# Altium project shahbazi2.PrjPcb
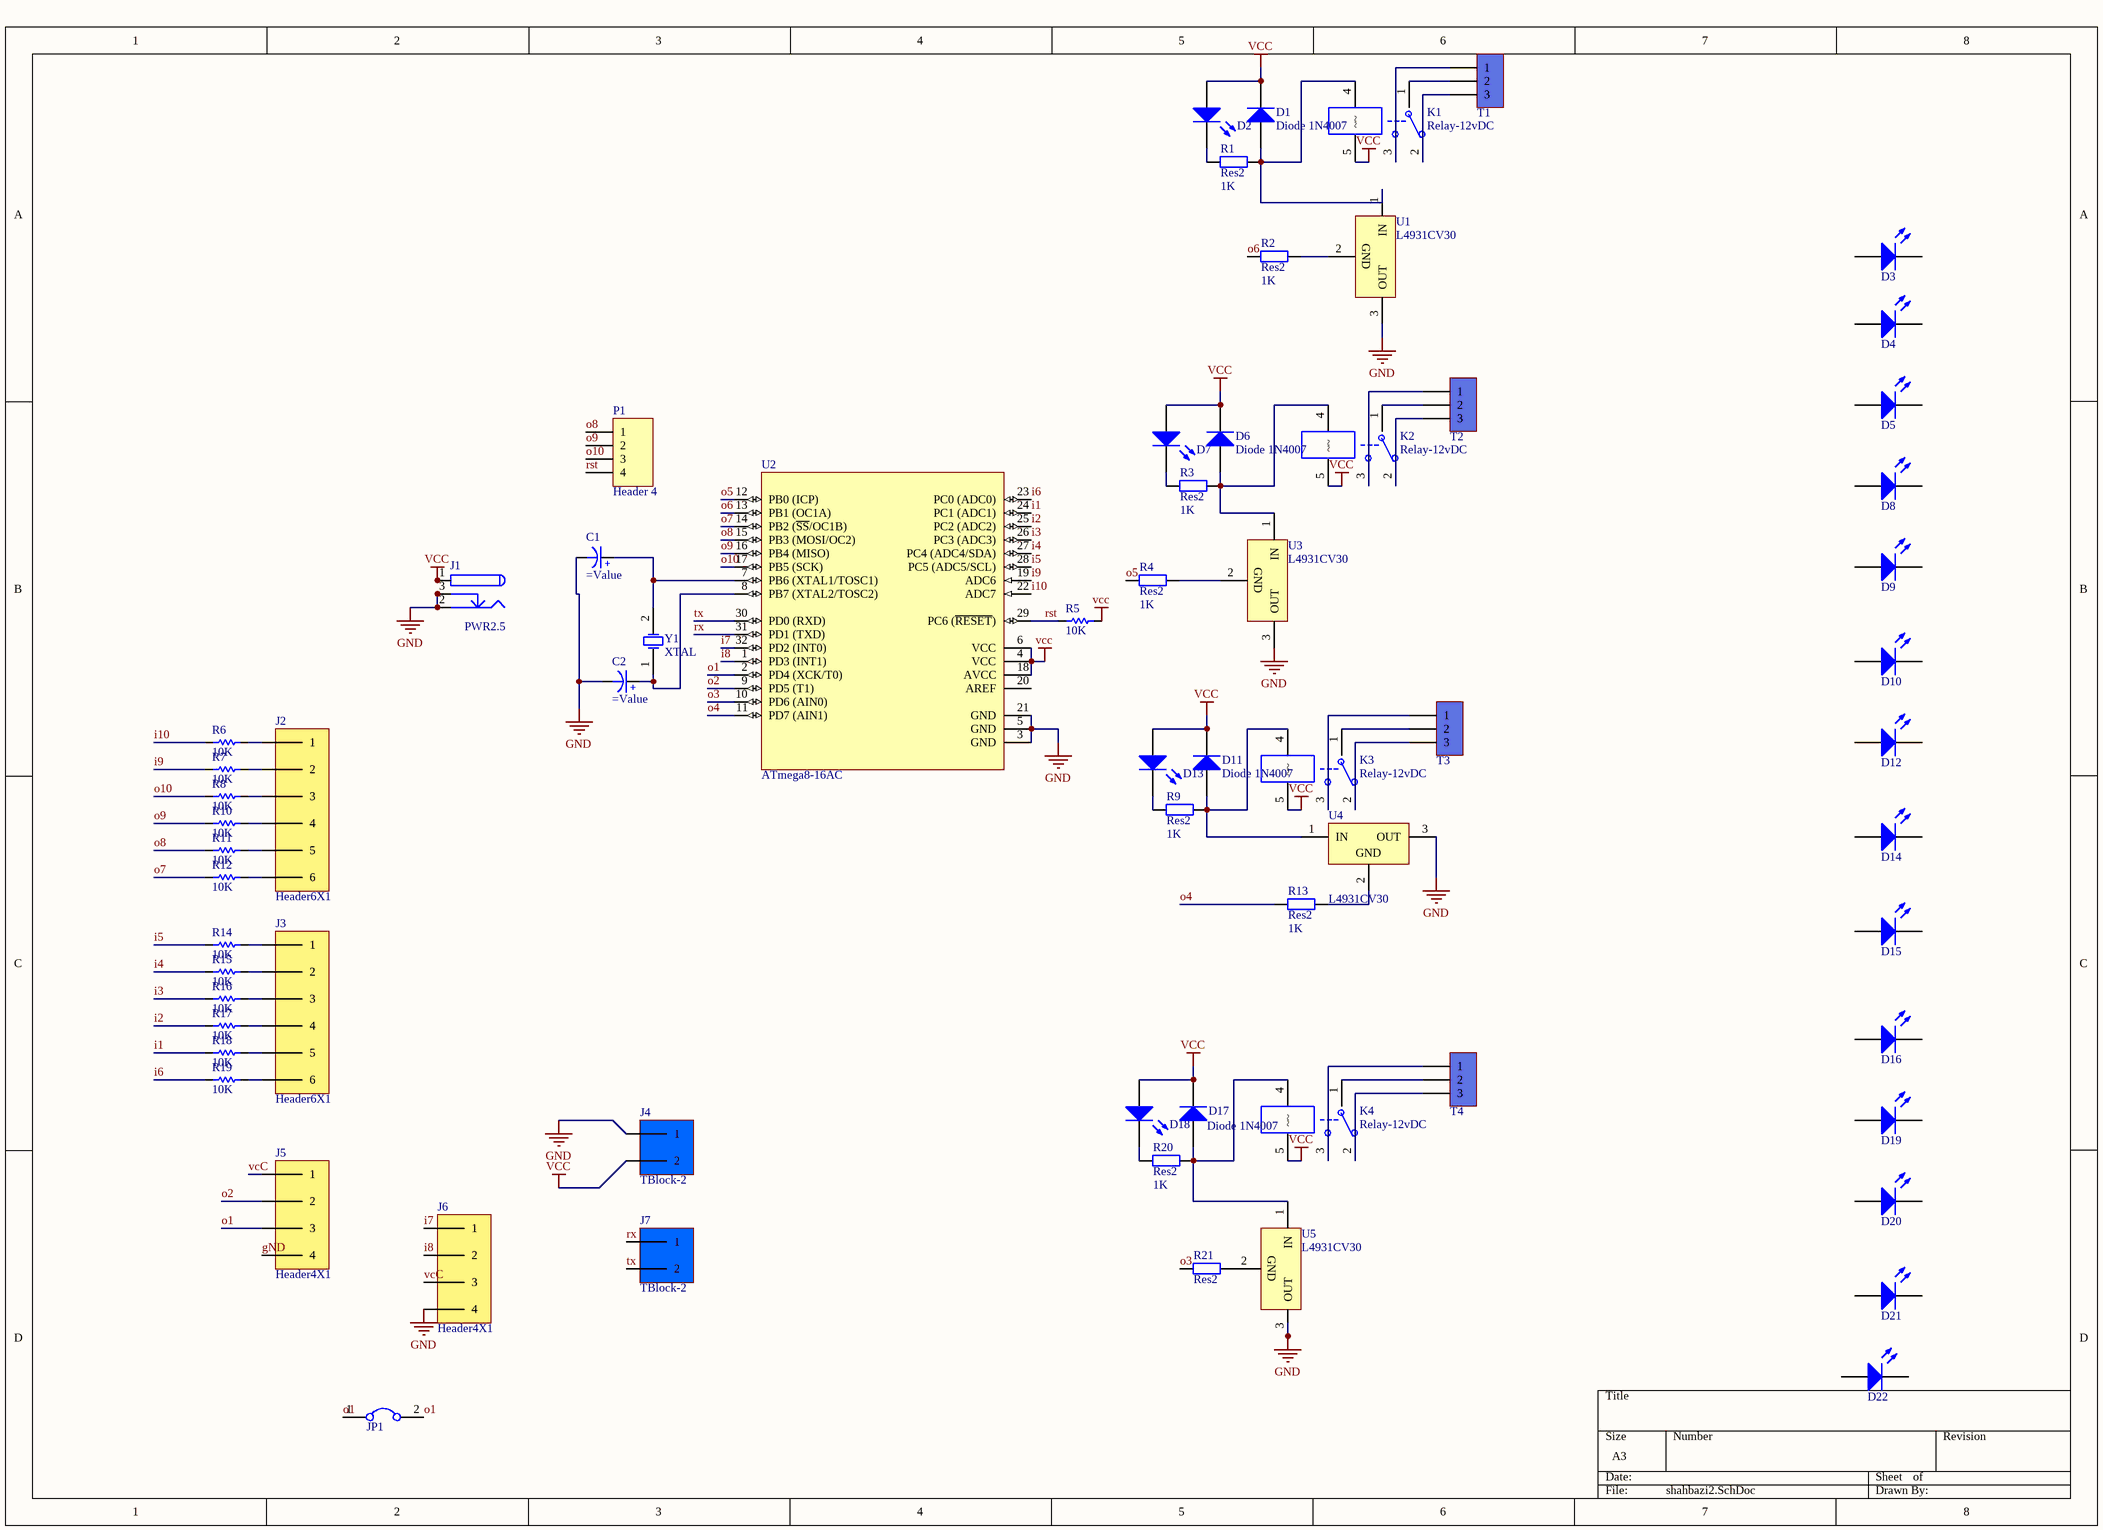
[diagram p0: shahbazi2.SchDoc]
1 sheet, 68 parts. Net scope: global (net labels, ports and power ports of the same name join across sheets).
Board file: shahbazi2.PcbDoc

## Sheet shahbazi2.SchDoc
size A3

### Parts
C1  (no value)  [ELEC-CAP-RAD10-20]
C2  (no value)  [ELEC-CAP-RAD10-20]
D1  Diode 1N4007  [DO-41]
D2  LED 3mm  [LED-3mm]  (value not drawn)
D3  LED 5mm  [LED-1]  (value not drawn)
D4  LED 5mm  [LED-1]  (value not drawn)
D5  LED 5mm  [LED-1]  (value not drawn)
D6  Diode 1N4007  [DO-41]
D7  LED 3mm  [LED-3mm]  (value not drawn)
D8  LED 5mm  [LED-1]  (value not drawn)
D9  LED 5mm  [LED-1]  (value not drawn)
D10  LED 5mm  [LED-1]  (value not drawn)
D11  Diode 1N4007  [DO-41]
D12  LED 5mm  [LED-1]  (value not drawn)
D13  LED 3mm  [LED-3mm]  (value not drawn)
D14  LED 5mm  [LED-1]  (value not drawn)
D15  LED 5mm  [LED-1]  (value not drawn)
D16  LED 5mm  [LED-1]  (value not drawn)
D17  Diode 1N4007  [DO-41]
D18  LED 3mm  [LED-3mm]  (value not drawn)
D19  LED 5mm  [LED-1]  (value not drawn)
D20  LED 5mm  [LED-1]  (value not drawn)
D21  LED 5mm  [LED-1]  (value not drawn)
D22  LED 5mm  [LED-1]  (value not drawn)
J1  PWR2.5  [KLD-0202]
J2  Header6X1  [HEADER 6X1]
J3  Header6X1  [HEADER 6X1]
J4  TBlock-2  [KF300-2 PIN]
J5  Header4X1  [HEADER 4X1]
J6  Header4X1  [HEADER 4X1]
J7  TBlock-2  [KF300-2 PIN]
JP1  Jumper  [Header 2X1]  (value not drawn)
K1  Relay-12vDC  [Relays]
K2  Relay-12vDC  [Relays]
K3  Relay-12vDC  [Relays]
K4  Relay-12vDC  [Relays]
P1  Header 4  [HDR1X4]
R1  Res2  value 1K  [Res50]
R2  Res2  value 1K  [Res50]
R3  Res2  value 1K  [Res50]
R4  Res2  value 1K  [Res50]
R5  10K  [RES 1206 (3216X08L)]
R6  10K  [Res-(1/4)]
R7  10K  [Res-(1/4)]
R8  10K  [Res-(1/4)]
R9  Res2  value 1K  [Res50]
R10  10K  [Res-(1/4)]
R11  10K  [Res-(1/4)]
R12  10K  [Res-(1/4)]
R13  Res2  value 1K  [Res50]
R14  10K  [Res-(1/4)]
R15  10K  [Res-(1/4)]
R16  10K  [Res-(1/4)]
R17  10K  [Res-(1/4)]
R18  10K  [Res-(1/4)]
R19  10K  [Res-(1/4)]
R20  Res2  value 1K  [Res50]
R21  Res2  [Res50]
T1  Terminal  [phoenix terminal R 3]  (value not drawn)
T2  Terminal  [phoenix terminal R 3]  (value not drawn)
T3  Terminal  [phoenix terminal R 3]  (value not drawn)
T4  Terminal  [phoenix terminal R 3]  (value not drawn)
U1  L4931CV30  [TO-220A]
U2  ATmega8-16AC  [32A_N]
U3  L4931CV30  [TO-220A]
U4  L4931CV30  [TO-220A]
U5  L4931CV30  [TO-220A]
Y1  XTAL  [R38]

### Nets
gND: C1.1(-) C2.1(-) J1.2 J1.2A J1.2B J1.3 J1.3A J1.3B J4.1 J5.4 J6.4 U1.3(OUT) U2.3(GND) U2.5(GND) U2.21(GND) U3.3(OUT) U4.3(OUT) U5.3(OUT)
vcC: D1.2(K) D2.1(A) D6.2(K) D7.1(A) D11.2(K) D13.1(A) D17.2(K) D18.1(A) J1.1 J1.1A J1.1B J4.2 J5.1 J6.3 K1.5 K2.5 K3.5 K4.5 R5.2 U2.4(VCC) U2.6(VCC) U2.18(AVCC)
i1: R18.1 U2.24(PC1_(ADC1))
i2: R17.1 U2.25(PC2_(ADC2))
i3: R16.1 U2.26(PC3_(ADC3))
i4: R15.1 U2.27(PC4_(ADC4/SDA))
i5: R14.1 U2.28(PC5_(ADC5/SCL))
i6: R19.1 U2.23(PC0_(ADC0))
i7: J6.1 U2.32(PD2_(INT0))
i8: J6.2 U2.1(PD3_(INT1))
i9: R7.1 U2.19(ADC6)
i10: R6.1 U2.22(ADC7)
o1: J5.3 JP1.1 JP1.2 U2.2(PD4_(XCK/T0))
o2: J5.2 U2.9(PD5_(T1))
o3: R21.1 U2.10(PD6_(AIN0))
o4: R13.1 U2.11(PD7_(AIN1))
o5: R4.1 U2.12(PB0_(ICP))
o6: R2.1 U2.13(PB1_(OC1A))
o7: R12.1 U2.14(PB2_(~{SS}/OC1B))
o8: P1.1 R11.1 U2.15(PB3_(MOSI/OC2))
o9: P1.2 R10.1 U2.16(PB4_(MISO))
o10: P1.3 R8.1 U2.17(PB5_(SCK))
rst: P1.4 R5.1 U2.29(PC6_(~{RESET}))
rx: J7.1 U2.31(PD1_(TXD))
tx: J7.2 U2.30(PD0_(RXD))
NetC1_2: C1.2(+) U2.7(PB6_(XTAL1/TOSC1)) Y1.2(OSC2)
NetC2_2: C2.2(+) U2.8(PB7_(XTAL2/TOSC2)) Y1.1(OSC1)
NetD1_1: D1.1(A) K1.4 R1.2 U1.1(IN)
NetD2_2: D2.2(K) R1.1
NetD6_1: D6.1(A) K2.4 R3.2 U3.1(IN)
NetD7_2: D7.2(K) R3.1
NetD11_1: D11.1(A) K3.4 R9.2 U4.1(IN)
NetD13_2: D13.2(K) R9.1
NetD17_1: D17.1(A) K4.4 R20.2 U5.1(IN)
NetD18_2: D18.2(K) R20.1
NetJ2_1: J2.1 R6.2
NetJ2_2: J2.2 R7.2
NetJ2_3: J2.3 R8.2
NetJ2_4: J2.4 R10.2
NetJ2_5: J2.5 R11.2
NetJ2_6: J2.6 R12.2
NetJ3_1: J3.1 R14.2
NetJ3_2: J3.2 R15.2
NetJ3_3: J3.3 R16.2
NetJ3_4: J3.4 R17.2
NetJ3_5: J3.5 R18.2
NetJ3_6: J3.6 R19.2
NetK1_1: K1.1(COM) T1.2
NetK1_2: K1.2(NC) T1.3
NetK1_3: K1.3(NO) T1.1
NetK2_1: K2.1(COM) T2.2
NetK2_2: K2.2(NC) T2.3
NetK2_3: K2.3(NO) T2.1
NetK3_1: K3.1(COM) T3.2
NetK3_2: K3.2(NC) T3.3
NetK3_3: K3.3(NO) T3.1
NetK4_1: K4.1(COM) T4.2
NetK4_2: K4.2(NC) T4.3
NetK4_3: K4.3(NO) T4.1
NetR2_2: R2.2 U1.2(GND)
NetR4_2: R4.2 U3.2(GND)
NetR13_2: R13.2 U4.2(GND)
NetR21_2: R21.2 U5.2(GND)

Not connected (* = marked no-connect by the designer): D3 1(A) 2(K); D4 1(A) 2(K); D5 1(A) 2(K); D8 1(A) 2(K); D9 1(A) 2(K); D10 1(A) 2(K); D12 1(A) 2(K); D14 1(A) 2(K); D15 1(A) 2(K); D16 1(A) 2(K); D19 1(A) 2(K); D20 1(A) 2(K); D21 1(A) 2(K); D22 1(A) 2(K); U2 20(AREF)

### Library data of the parts
C1 C2 = Capacitor Electrolytic: Electrolytic Capacitor
D1 D6 D11 D17 = Diode 1N4007: 1 Amp General Purpose Rectifier; Published: 8-Jun-2000; LatestRevisionDate: 17-Jul-2002; LatestRevisionNote: Re-released for DXP Platform.; DatasheetVersion: 1998; PackageVersion: Aug-1999; PackageReference: DO-41; Publisher: Altium Limited; PackageDescription: Diode, Axial; Body 5.2 x 2.7 mm (LxDia. max), Lead Dia. 0.86 mm (max); Code_JEDEC: DO-204-AL; ComponentLink1Description: Manufacturer Link; ComponentLink1URL: http://www.fairchildsemi.com/; ComponentLink2Description: Datasheet; ComponentLink2URL: http://www.fairchildsemi.com/ds/1N%2F1N4001.pdf
D2 D7 D13 D18 = LED 3mm: Typical LED; Designer: Seyed Mohsen Ghasemian; Published: 02/04/2012; PackageReference: LED; Publisher: www.picpars.com; PackageDescription: LED; 2 Leads
D3-D5 D8-D10 D12 D14-D16 D19-D22 = LED 5mm: Typical LED; Designer: Seyed Mohsen Ghasemian; Published: 07/31/2012; PackageReference: LED; Publisher: www.picpars.com; PackageDescription: LED; 2 Leads
J1 = PWR2.5: Low Voltage Power Supply Connector; Published: 17-Dec-2003; DatasheetDocument: 09-May-2002; Publisher: Altium Limited; ComponentLink1Description: Manufacturer Link; ComponentLink1URL: http://domino.kycon.com/internet/Products.html
K1-K4 = Relay-05vDC: Relay-05vDC-240AC 5A; Designer: Seyed Mohsen Ghasemain; ComponentLinkURL: www.picpars.com
P1 = Header 4: Header, 4-Pin; LatestRevisionDate: 17-Jul-2002; LatestRevisionNote: Re-released for DXP Platform.; Publisher: Altium Limited
R1-R4 R9 R13 R20 R21 = Res2: Resistor; Published: 8-Jun-2000; LatestRevisionDate: 17-Jul-2002; LatestRevisionNote: Re-released for DXP Platform.; Publisher: Altium Limited; PackageDescription: Axial Device, Thru-Hole; 2 Leads; 0.4 in Pin Spacing
  R1-R4 R13 R20 R21: PackageReference: AXIAL-0.4
  R9: PackageReference: Res50
R5-R8 R10-R12 R14-R19 = Resistor: Tolerance: 5%; Power: 1/4 W; Value: 10K
T1-T4 = Terminal 1*3: phoenix terminal R 3; Designer: Seyed Mohsen Ghasemain; E-mail: picpars@gmail.com; ComponentLinkURL: www.picpars.com
U1 U3-U5 = L4931CV30: 250mA, Very Low Drop ( 0.4V) Voltage Regulator; Published: 24-Aug-2001; LatestRevisionDate: 06-Jun-2005; LatestRevisionNote: PCB Pin sequence re-ordered.; DatasheetVersion: Apr-1999; PackageVersion: Jul-2004; PackageReference: TO-220A; Publisher: Altium Limited; PackageDescription: TO, Thru-Hole, Vertical, Heatsink Mounted; 3 In-Line Leads; Pitch 2.54 mm; ComponentLink1Description: Manufacturer Link; ComponentLink1URL: http://www.st.com/; ComponentLink2Description: Datasheet; ComponentLink2URL: http://www.st.com/stonline/products/literature/ds/4340/l4931abxx15.pdf
U2 = ATmega8-16AC: 8-Bit AVR Microcontroller with 8K Bytes of In-System Programmable Flash Memory; Published: 17-Sep-2003; LatestRevisionDate: 16-Oct-2006; LatestRevisionNote: IPC-7351 Footprint Added.; DatasheetVersion: 2486H-AVR-09/02; PackageVersion: revB, Oct-2001; PackageReference: 32A; Publisher: Altium Limited; PackageDescription: 32-Lead, 7x7x1.0 mm Body, 0.8mm Lead Pitch, Thin Profile Plastic Quad Flat Package (TQFP); Supplier 1: Digi-Key; Supplier Part Number 1: ATMEGA8-16AC-ND; Supplier 2: Mouser; Supplier Part Number 2: 556-ATMEGA8-16AC; Code_JEDEC: MS-026-ABA; ComponentLink1Description: Datasheet; ComponentLink1URL: http://www.atmel.com/dyn/resources/prod_documents/doc2486.pdf; ComponentLink2Description: Atmel.com Home; ComponentLink2URL: http://www.atmel.com
Y1 = XTAL: Crystal Oscillator; Published: 8-Jun-2000; LatestRevisionDate: 17-Jul-2002; LatestRevisionNote: Re-released for DXP Platform.; PackageReference: R38; Publisher: Altium Limited; PackageDescription: Crystal, Thru-Hole; 2 Leads; Body 3.1 x 8.2 mm (Dia.xH)